# Altium schematic sheet NKK+DOF.SchDoc
size A4
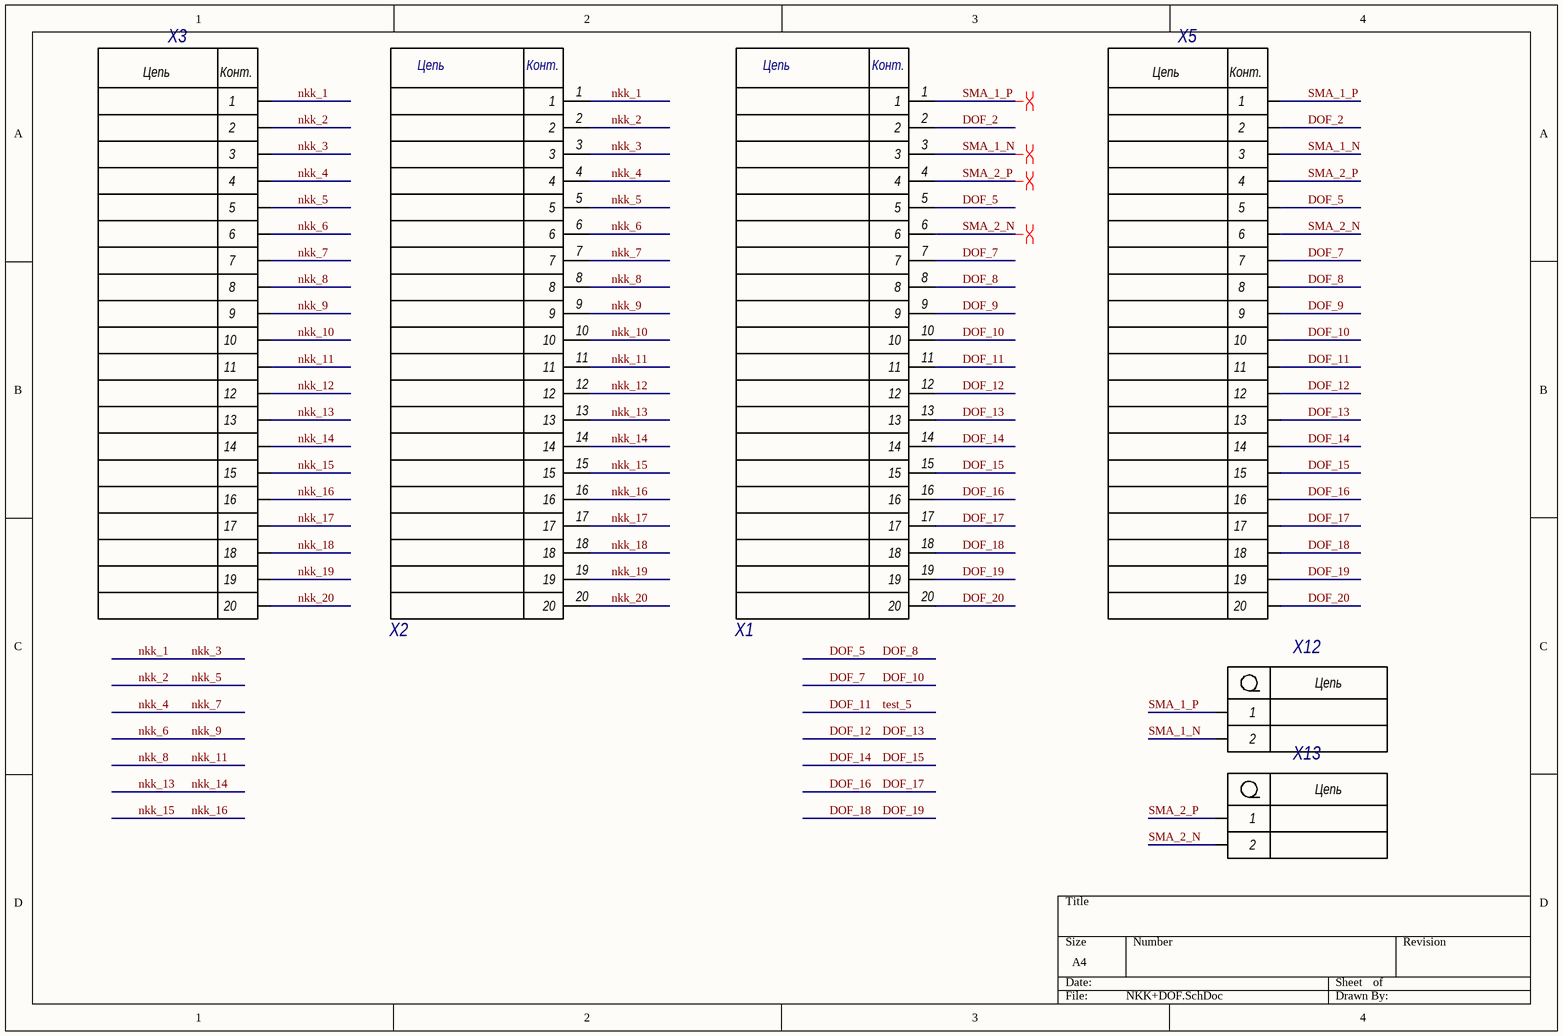
[diagram p0: NKK+DOF.SchDoc]

## Parts
X1  2x10  [5011902017]  (value not drawn)
X2  2x10  [5011902017]  (value not drawn)
X3  PLD-20  [PLD-20]  (value not drawn)
X5  PLD-20  [PLD-20]  (value not drawn)
X12  SMA JACK  [SMA_THROUGH_HOLE]  (value not drawn)
X13  SMA JACK  [SMA_THROUGH_HOLE]  (value not drawn)

## Nets
DOF_2: X1.2 X5.2
DOF_5: X1.5 X1.8 X5.5 X5.8  [also labelled DOF_8]
DOF_9: X1.9 X5.9
DOF_10: X1.7 X1.10 X5.7 X5.10  [also labelled DOF_7]
DOF_11: X1.11 X5.11  [also labelled test_5]
DOF_12: X1.12 X1.13 X5.12 X5.13  [also labelled DOF_13]
DOF_14: X1.14 X1.15 X5.14 X5.15  [also labelled DOF_15]
DOF_16: X1.16 X1.17 X5.16 X5.17  [also labelled DOF_17]
DOF_18: X1.18 X1.19 X5.18 X5.19  [also labelled DOF_19]
DOF_20: X1.20 X5.20
nkk_1: X2.1 X2.3 X3.1 X3.3  [also labelled nkk_3]
nkk_2: X2.2 X2.5 X3.2 X3.5  [also labelled nkk_5]
nkk_4: X2.4 X2.7 X3.4 X3.7  [also labelled nkk_7]
nkk_6: X2.6 X2.9 X3.6 X3.9  [also labelled nkk_9]
nkk_10: X2.10 X3.10
nkk_11: X2.8 X2.11 X3.8 X3.11  [also labelled nkk_8]
nkk_12: X2.12 X3.12
nkk_13: X2.13 X2.14 X3.13 X3.14  [also labelled nkk_14]
nkk_15: X2.15 X2.16 X3.15 X3.16  [also labelled nkk_16]
nkk_17: X2.17 X3.17
nkk_18: X2.18 X3.18
nkk_19: X2.19 X3.19
nkk_20: X2.20 X3.20
SMA_1_N: X1.3 X5.3 X12.2
SMA_1_P: X1.1 X5.1 X12.1
SMA_2_N: X1.6 X5.6 X13.2
SMA_2_P: X1.4 X5.4 X13.1

## Layout directives
differential pair: SMA_1_N, SMA_1_P, SMA_2_N, SMA_2_P

## Notes on the sheet
- (in symbol 5011902017) Цепь; Конт.
- (in symbol PLD-20 2.54mm) Цепь; Конт.
- (in symbol WM5543-ND) Цепь

## Library data of the parts
X1 X2 = 5011902017: CONN HEADER SMD 20POS 1MM; PartNumberFrom1C: Вилка Molex 5011902017; Manufacturer: Molex; Код: 181; 1CType: Вилка; Extended Price: $571.24/500; Number of Positions: 20; Number of Positions Loaded: ALL; Pitch - Mating: 0.039" (1.00mm); Row Spacing: 0.105" (2.66mm); System: Connector; PartNumber: 5011902017; PartNumberFrom1C_accuracy: Вилка Molex 5011902017; OrderCode: 5011902017; Unit Price: $1.76; Packaging: Cut Tape (CT); Series: Pico-Clasp 501190; Contact Type: Male Pin; Number of Rows: 2; Mounting Type: Surface Mount; Fastening Type: Latch Holder; Termination: Solder; Contact Finish Thickness: 3.90µin (0.099µm); ComponentLink: https://www.digikey.com/product-detail/en/molex/5011902017/WM7907CT-ND/1531557; ComponentLink1URL: https://www.digikey.com/product-detail/en/molex/5011902017/WM7907CT-ND/1531557; ComponentLink1Description: Технические характеристики
X3 X5 = PLD-20 2.54mm: штыри на плату двурядные; PartNumberFrom1C: Штырь PLD-20; Код: 27; 1CType: Штырь; Number of Positions: 20; Pitch - Mating: 2,54 мм; System: Connector; PartNumber: PLD-20 2.54mm; PartNumberFrom1C_accuracy: Штырь PLD-20; OrderCode: PLD-20; Mounting Type: Through Hole; ComponentLink1Description: Технические характеристики
X12 X13 = WM5543-ND: CONN SMA JACK STR 50 OHM PCB; PartNumberFrom1C: Розетка Molex WM5543-ND; Manufacturer: Molex; Код: 52; 1CType: Розетка; Number of Positions: 1; System: Connector; PartNumber: WM5543-ND; PartNumberFrom1C_accuracy: Розетка Molex WM5543-ND; OrderCode: WM5543-ND; Mounting Type: Through Hole; ComponentLink: http://www.digikey.com/product-detail/en/0733910060/WM5543-ND/1465165; ComponentLink1URL: http://www.digikey.com/product-detail/en/0733910060/WM5543-ND/1465165; ComponentLink1Description: Технические характеристики